# Altium schematic sheet PorteLogique.SchDoc: Porte Logique
size A4; Date: 25/11/2024; Author: Lucas Taraire; DrawnBy: Lucas Taraire; SheetNumber: 1; SheetTotal: 7
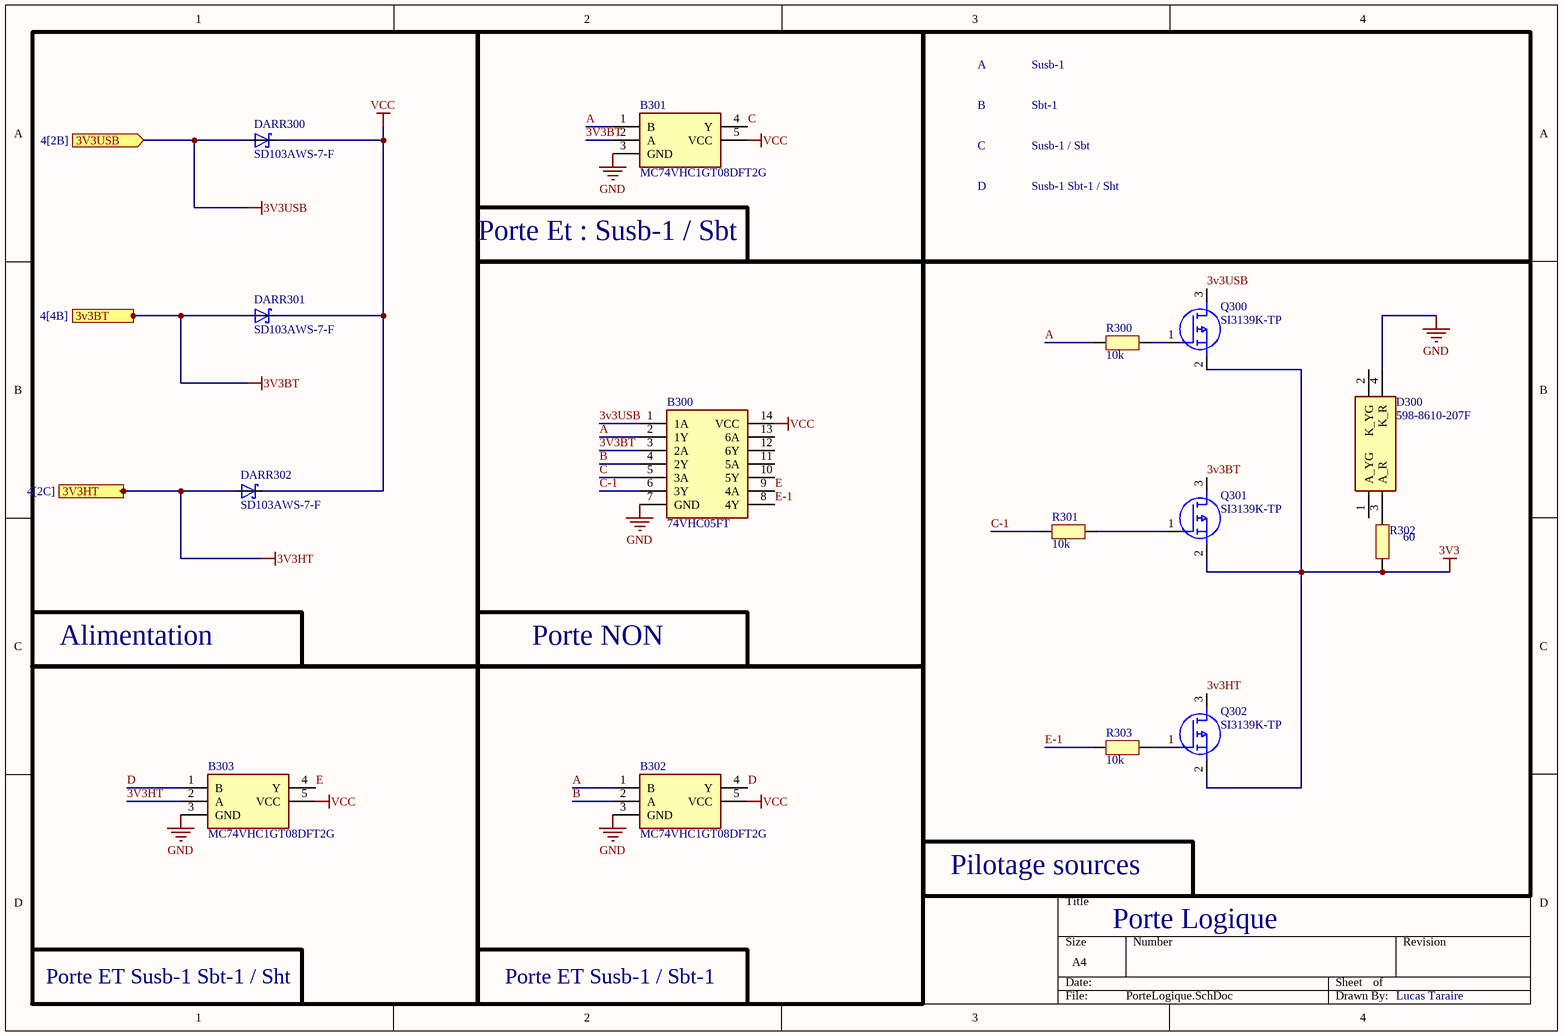
[diagram p0: PorteLogique.SchDoc]

## Parts
B300  74VHC05FT  [SOP65P640X120-14N]
B301  MC74VHC1GT08DFT2G  [SOT65P210X110-5N]
B302  MC74VHC1GT08DFT2G  [SOT65P210X110-5N]
B303  MC74VHC1GT08DFT2G  [SOT65P210X110-5N]
D300  598-8610-207F  [5988610207F]
DARR300  SD103AWS-7-F  [SD103AWS-7-F]
DARR301  SD103AWS-7-F  [SD103AWS-7-F]
DARR302  SD103AWS-7-F  [SD103AWS-7-F]
Q300  SI3139K-TP  [SI3139K-TP]
Q301  SI3139K-TP  [SI3139K-TP]
Q302  SI3139K-TP  [SI3139K-TP]
R300  10k  [RESC1005X06N]
R301  10k  [RESC1005X06N]
R302  60  [RESC1005X06N]
R303  10k  [RESC1005X06N]

## Blocks framed on the sheet
Porte Et : Susb-1 / Sbt: B301
Pilotage sources: D300 Q300-Q302 R300-R303
Alimentation: B303
Porte NON: B302

## Ports
3v3BT (in, see 4[4B]), 3V3HT (in, see 4[2C]), 3V3USB (in, see 4[2B])

## Nets
3V3: Q300.2(S) Q301.2(S) Q302.2(S) R302.1
3V3BT: B300.3(2A) B301.2(A) DARR301.2(A) Q301.3(D) ; port 3v3BT
3V3HT: B303.2(A) DARR302.2(A) Q302.3(D) ; port 3V3HT
3v3USB: B300.1(1A) DARR300.2(A) Q300.3(D) ; port 3V3USB
GND: B300.7(GND) B301.3(GND) B302.3(GND) B303.3(GND) D300.4(K_R)
VCC: B300.14(VCC) B301.5(VCC) B302.5(VCC) B303.5(VCC) DARR300.1(C) DARR301.1(C) DARR302.1(C)
A: B300.2(1Y) B301.1(B) B302.1(B) R300.1
B: B300.4(2Y) B302.2(A)
C: B300.5(3A) B301.4(Y)
C-1: B300.6(3Y) R301.1
D: B302.4(Y) B303.1(B)
E: B300.9(4A) B303.4(Y)
E-1: B300.8(4Y) R303.1
NetQ300_1: Q300.1(G) R300.2
NetQ301_1: Q301.1(G) R301.2
NetQ302_1: Q302.1(G) R303.2

Not connected (* = marked no-connect by the designer): B300 10(5Y) 11(5A) 12(6Y) 13(6A); D300 1(A_YG) 2(K_YG) 3(A_R); R302 2

## Notes on the sheet
- A
- B
- Susb-1
- Sbt-1
- C
- Susb-1 / Sbt
- D
- Susb-1 Sbt-1 / Sht
- Porte ET Susb-1 Sbt-1 / Sht
- Porte ET Susb-1 / Sbt-1

## Library data of the parts
B300 = 74VHC05FT: Logic Gates CMOS LOGIC IC INVERTER; Manufacturer_Name: Toshiba; Manufacturer_Part_Number: 74VHC05FT; Mouser Part Number: 757-74VHC05FT
B301-B303 = MC74VHC1GT08DFT2G: Single 2-Input AND Gate, TTL Level; Manufacturer_Name: onsemi; Manufacturer_Part_Number: MC74VHC1GT08DFT2G; Parameter 3: *
D300 = 598-8610-207F: Standard LEDs - SMD Red/Green WC 80/50mcd 645/570nm; Manufacturer_Name: Dialight; Geometry.Height: 0.8mm; Manufacturer_Part_Number: 598-8610-207F; Mouser Part Number: 645-598-8610-207F; Mouser Price/Stock: https://www.mouser.co.uk/ProductDetail/Dialight/598-8610-207F?qs=7JStj%2FjQ2SFuCjosqwklHQ%3D%3D; Arrow Part Number: 598-8610-207F; Arrow Price/Stock: https://www.arrow.com/en/products/598-8610-207f/dialight?region=nac; Datasheet Link: https://media.digikey.com/pdf/Data%20Sheets/Dialight%20PDFs/598%20Series%201210%20Pkg%20Bi-Color.pdf
DARR300-DARR302 = SD103AWS-7-F: Diode Array 3 Independent Schottky 40V 175mA Surface Mount 6-TSSOP, SC-88, SOT-363
Q300-Q302 = SI3139K-TP: MOSFET P-Channel MOSFET
R300-R303 = Resistor